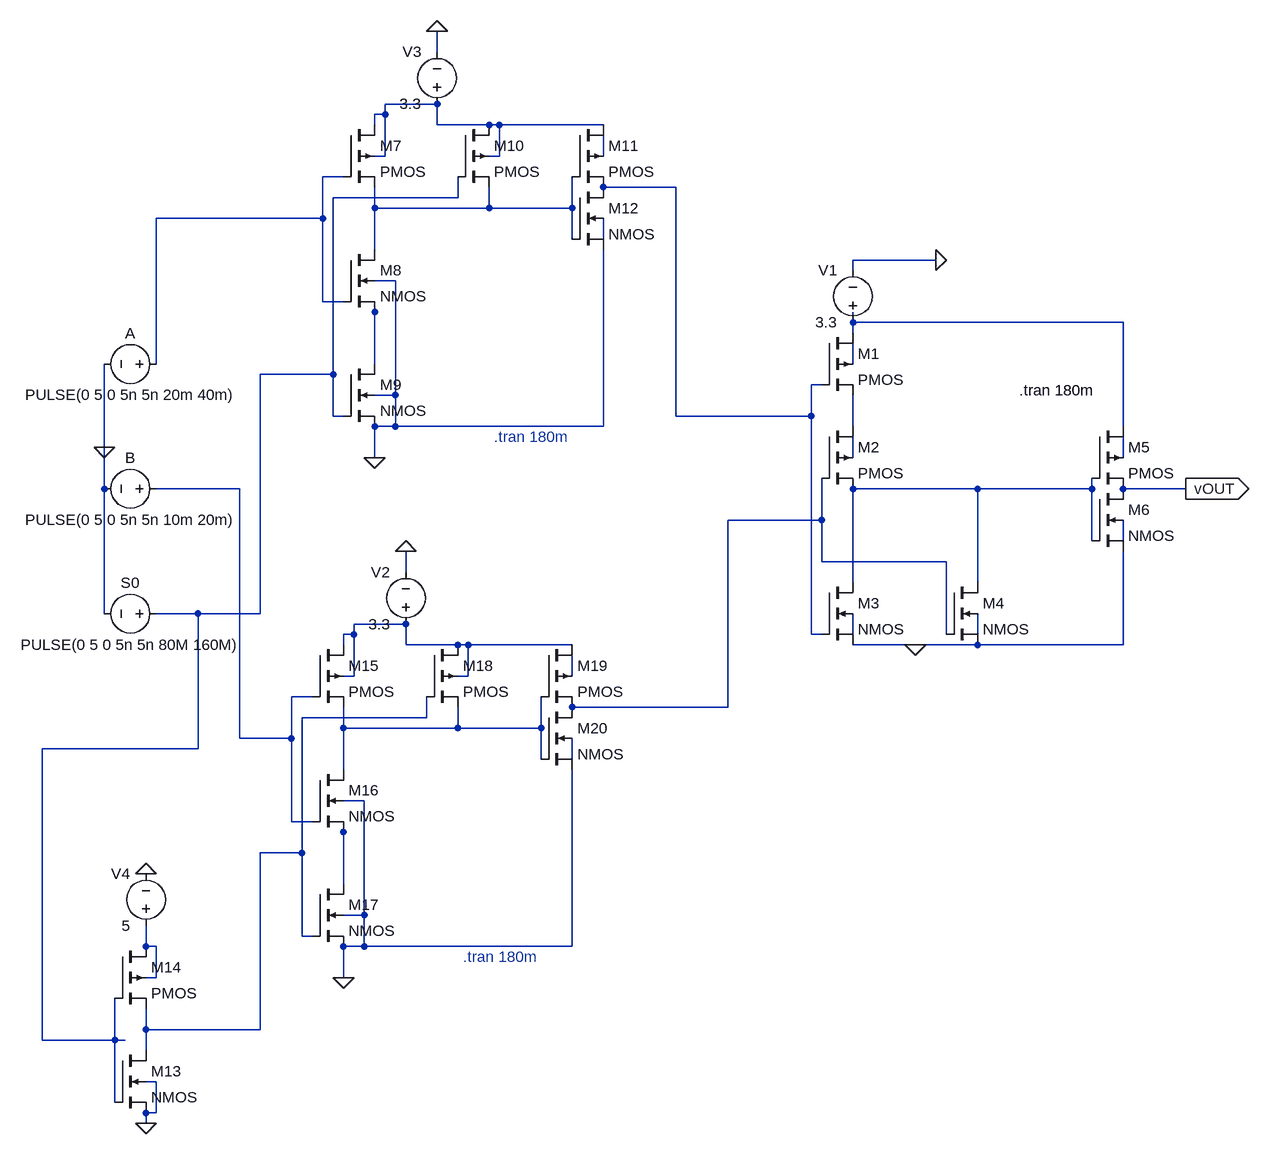
[diagram p0: schematic mux2_1.asc]
mux2_1.asc, the LTspice schematic file:
Version 4
SHEET 1 960 1140
WIRE -592 -528 -592 -560
WIRE -592 -448 -672 -448
WIRE -672 -432 -672 -448
WIRE -672 -432 -688 -432
WIRE -688 -416 -688 -432
WIRE -592 -416 -592 -448
WIRE -512 -416 -592 -416
WIRE -496 -416 -512 -416
WIRE -336 -416 -496 -416
WIRE -672 -368 -672 -432
WIRE -672 -368 -688 -368
WIRE -496 -368 -496 -416
WIRE -496 -368 -512 -368
WIRE -336 -368 -336 -400
WIRE -736 -336 -768 -336
WIRE -224 -320 -336 -320
WIRE -560 -304 -560 -336
WIRE -560 -304 -752 -304
WIRE -688 -288 -688 -320
WIRE -512 -288 -512 -320
WIRE -512 -288 -688 -288
WIRE -384 -288 -384 -336
WIRE -384 -288 -512 -288
WIRE -768 -272 -768 -336
WIRE -768 -272 -1024 -272
WIRE -384 -240 -384 -288
WIRE -336 -240 -336 -272
WIRE -688 -224 -688 -288
WIRE 176 -208 48 -208
WIRE 48 -192 48 -208
WIRE -656 -176 -688 -176
WIRE -768 -144 -768 -272
WIRE -736 -144 -768 -144
WIRE -688 -128 -688 -144
WIRE 48 -112 48 -128
WIRE 464 -112 48 -112
WIRE 48 -96 48 -112
WIRE -1024 -48 -1024 -272
WIRE -688 -48 -688 -128
WIRE 48 -48 48 -80
WIRE -752 -32 -752 -304
WIRE -752 -32 -864 -32
WIRE 0 -16 -16 -16
WIRE -656 0 -656 -176
WIRE -656 0 -688 0
WIRE -752 32 -752 -32
WIRE -736 32 -752 32
WIRE -224 32 -224 -320
WIRE -16 32 -16 -16
WIRE -16 32 -224 32
WIRE -656 48 -656 0
WIRE -656 48 -688 48
WIRE -336 48 -336 -224
WIRE -336 48 -656 48
WIRE 48 48 48 0
WIRE 464 48 464 -112
WIRE -1104 80 -1104 -48
WIRE -688 96 -688 48
WIRE 48 96 48 64
WIRE 464 96 464 64
WIRE -1104 144 -1104 80
WIRE -896 144 -1024 144
WIRE 240 144 48 144
WIRE 416 144 416 128
WIRE 416 144 240 144
WIRE 560 144 464 144
WIRE 0 192 0 128
WIRE 0 192 -144 192
WIRE 416 224 416 144
WIRE 464 224 464 192
WIRE 0 256 0 192
WIRE 192 256 0 256
WIRE -640 272 -640 240
WIRE 48 288 48 144
WIRE 240 288 240 144
WIRE -1104 336 -1104 144
WIRE -960 336 -1024 336
WIRE -864 336 -864 -32
WIRE -864 336 -960 336
WIRE -640 352 -720 352
WIRE -720 368 -720 352
WIRE -720 368 -736 368
WIRE -16 368 -16 32
WIRE 0 368 -16 368
WIRE 48 368 48 336
WIRE 192 368 192 256
WIRE 240 368 240 336
WIRE -736 384 -736 368
WIRE -640 384 -640 352
WIRE -560 384 -640 384
WIRE -544 384 -560 384
WIRE -384 384 -544 384
WIRE 144 384 48 384
WIRE 240 384 144 384
WIRE 464 384 464 240
WIRE 464 384 240 384
WIRE -720 432 -720 368
WIRE -720 432 -736 432
WIRE -544 432 -544 384
WIRE -544 432 -560 432
WIRE -384 432 -384 400
WIRE -784 464 -816 464
WIRE -144 480 -144 192
WIRE -144 480 -384 480
WIRE -608 496 -608 464
WIRE -608 496 -800 496
WIRE -736 512 -736 480
WIRE -560 512 -560 480
WIRE -560 512 -736 512
WIRE -432 512 -432 464
WIRE -432 512 -560 512
WIRE -896 528 -896 144
WIRE -816 528 -816 464
WIRE -816 528 -896 528
WIRE -960 544 -960 336
WIRE -960 544 -1200 544
WIRE -432 560 -432 512
WIRE -384 560 -384 528
WIRE -736 576 -736 512
WIRE -704 624 -736 624
WIRE -816 656 -816 528
WIRE -784 656 -816 656
WIRE -736 672 -736 656
WIRE -800 704 -800 496
WIRE -800 704 -864 704
WIRE -736 752 -736 672
WIRE -704 800 -704 624
WIRE -704 800 -736 800
WIRE -800 832 -800 704
WIRE -784 832 -800 832
WIRE -1040 848 -1040 816
WIRE -1024 848 -1040 848
WIRE -704 848 -704 800
WIRE -704 848 -736 848
WIRE -384 848 -384 576
WIRE -384 848 -704 848
WIRE -1024 896 -1024 848
WIRE -1024 896 -1040 896
WIRE -736 896 -736 848
WIRE -1040 976 -1040 944
WIRE -864 976 -864 704
WIRE -864 976 -1040 976
WIRE -1200 992 -1200 544
WIRE -1088 992 -1088 928
WIRE -1088 992 -1200 992
WIRE -1072 992 -1088 992
WIRE -1040 1008 -1040 976
WIRE -1024 1056 -1040 1056
WIRE -1088 1088 -1088 992
WIRE -1024 1104 -1024 1056
WIRE -1024 1104 -1040 1104
WIRE -1040 1120 -1040 1104
FLAG 176 -208 0
FLAG 144 384 0
FLAG -688 96 0
FLAG -592 -560 0
FLAG -1040 1120 0
FLAG -1040 736 0
FLAG -1104 80 0
FLAG -736 896 0
FLAG -640 240 0
FLAG 560 144 vOUT
IOPIN 560 144 Out
SYMBOL pmos4 0 -96 R0
SYMATTR InstName M1
SYMBOL pmos4 0 48 R0
SYMATTR InstName M2
SYMBOL nmos4 0 288 R0
SYMATTR InstName M3
SYMBOL nmos4 192 288 R0
SYMATTR InstName M4
SYMBOL pmos4 416 48 R0
SYMATTR InstName M5
SYMBOL nmos4 416 144 R0
SYMATTR InstName M6
SYMBOL pmos4 -736 -416 R0
SYMATTR InstName M7
SYMATTR Value2 l=1040nm w=1040nm
SYMBOL nmos4 -736 -224 R0
SYMATTR InstName M8
SYMATTR Value2 l=1040nm w=1040nm
SYMBOL nmos4 -736 -48 R0
SYMATTR InstName M9
SYMATTR Value2 l=1040nm w=1040nm
SYMBOL voltage -592 -432 R180
WINDOW 0 24 96 Left 2
WINDOW 3 24 16 Left 2
WINDOW 123 0 0 Left 0
WINDOW 39 0 0 Left 0
SYMATTR InstName V3
SYMATTR Value 3.3
SYMBOL pmos4 -560 -416 R0
SYMATTR InstName M10
SYMBOL pmos4 -384 -416 R0
SYMATTR InstName M11
SYMBOL nmos4 -384 -320 R0
SYMATTR InstName M12
SYMBOL nmos4 -1088 1008 R0
SYMATTR InstName M13
SYMBOL pmos4 -1088 848 R0
SYMATTR InstName M14
SYMBOL voltage -1040 832 R180
WINDOW 0 24 96 Left 2
WINDOW 3 24 16 Left 2
WINDOW 123 0 0 Left 0
WINDOW 39 0 0 Left 0
SYMATTR InstName V4
SYMATTR Value 5
SYMBOL voltage 48 -96 R180
WINDOW 0 24 96 Left 2
WINDOW 3 24 16 Left 2
WINDOW 123 0 0 Left 0
WINDOW 39 0 0 Left 0
SYMATTR InstName V1
SYMATTR Value 3.3
SYMBOL voltage -1008 -48 R90
WINDOW 0 -32 56 VBottom 2
WINDOW 3 32 56 VTop 2
WINDOW 123 0 0 Left 0
WINDOW 39 0 0 Left 0
SYMATTR InstName A
SYMATTR Value PULSE(0 5 0 5n 5n 20m 40m)
SYMBOL voltage -1008 144 R90
WINDOW 0 -32 56 VBottom 2
WINDOW 3 32 56 VTop 2
WINDOW 123 0 0 Left 0
WINDOW 39 0 0 Left 0
SYMATTR InstName B
SYMATTR Value PULSE(0 5 0 5n 5n 10m 20m)
SYMBOL voltage -1008 336 R90
WINDOW 0 -32 56 VBottom 2
WINDOW 3 32 56 VTop 2
WINDOW 123 0 0 Left 0
WINDOW 39 0 0 Left 0
SYMATTR InstName S0
SYMATTR Value PULSE(0 5 0 5n 5n 80M 160M)
SYMBOL pmos4 -784 384 R0
SYMATTR InstName M15
SYMATTR Value2 l=1040nm w=1040nm
SYMBOL nmos4 -784 576 R0
SYMATTR InstName M16
SYMATTR Value2 l=1040nm w=1040nm
SYMBOL nmos4 -784 752 R0
SYMATTR InstName M17
SYMATTR Value2 l=1040nm w=1040nm
SYMBOL voltage -640 368 R180
WINDOW 0 24 96 Left 2
WINDOW 3 24 16 Left 2
WINDOW 123 0 0 Left 0
WINDOW 39 0 0 Left 0
SYMATTR InstName V2
SYMATTR Value 3.3
SYMBOL pmos4 -608 384 R0
SYMATTR InstName M18
SYMBOL pmos4 -432 384 R0
SYMATTR InstName M19
SYMBOL nmos4 -432 480 R0
SYMATTR InstName M20
TEXT 304 -8 Left 2 !.tran 180m
TEXT -504 64 Left 2 ;.tran 180m
TEXT -552 864 Left 2 ;.tran 180m

The netlist it stands for:
* mux2_1.asc
M1 N009 N004 N011 N010 PMOS
M2 N011 N016 N015 N012 PMOS
M3 N015 N004 0 N019 NMOS
M4 N015 N016 0 N020 NMOS
M5 N009 N015 vOUT N013 PMOS
M6 vOUT N015 0 N017 NMOS
M7 N001 N003 N006 N001 PMOS l=1040nm w=1040nm
M8 N006 N003 N008 0 NMOS l=1040nm w=1040nm
M9 N008 N005 0 0 NMOS l=1040nm w=1040nm
V3 N001 0 3.3
M10 N001 N005 N006 N001 PMOS
M11 N001 N006 N004 N002 PMOS
M12 N004 N006 0 N007 NMOS
M13 N022 N005 0 0 NMOS
M14 N026 N005 N022 N026 PMOS
V4 N026 0 5
V1 N009 0 3.3
V§A N003 0 PULSE(0 5 0 5n 5n 20m 40m)
V§B N014 0 PULSE(0 5 0 5n 5n 10m 20m)
V§S0 N005 0 PULSE(0 5 0 5n 5n 80M 160M)
M15 N018 N014 N023 N018 PMOS l=1040nm w=1040nm
M16 N023 N014 N025 0 NMOS l=1040nm w=1040nm
M17 N025 N022 0 0 NMOS l=1040nm w=1040nm
V2 N018 0 3.3
M18 N018 N022 N023 N018 PMOS
M19 N018 N023 N016 N021 PMOS
M20 N016 N023 0 N024 NMOS
.model NMOS NMOS
.model PMOS PMOS
.lib standard.mos
.tran 180m
* .tran 180m
* .tran 180m
.backanno
.end